# EAGLE design MySens-easyRS485-v002 (EAGLE 7.3.0)
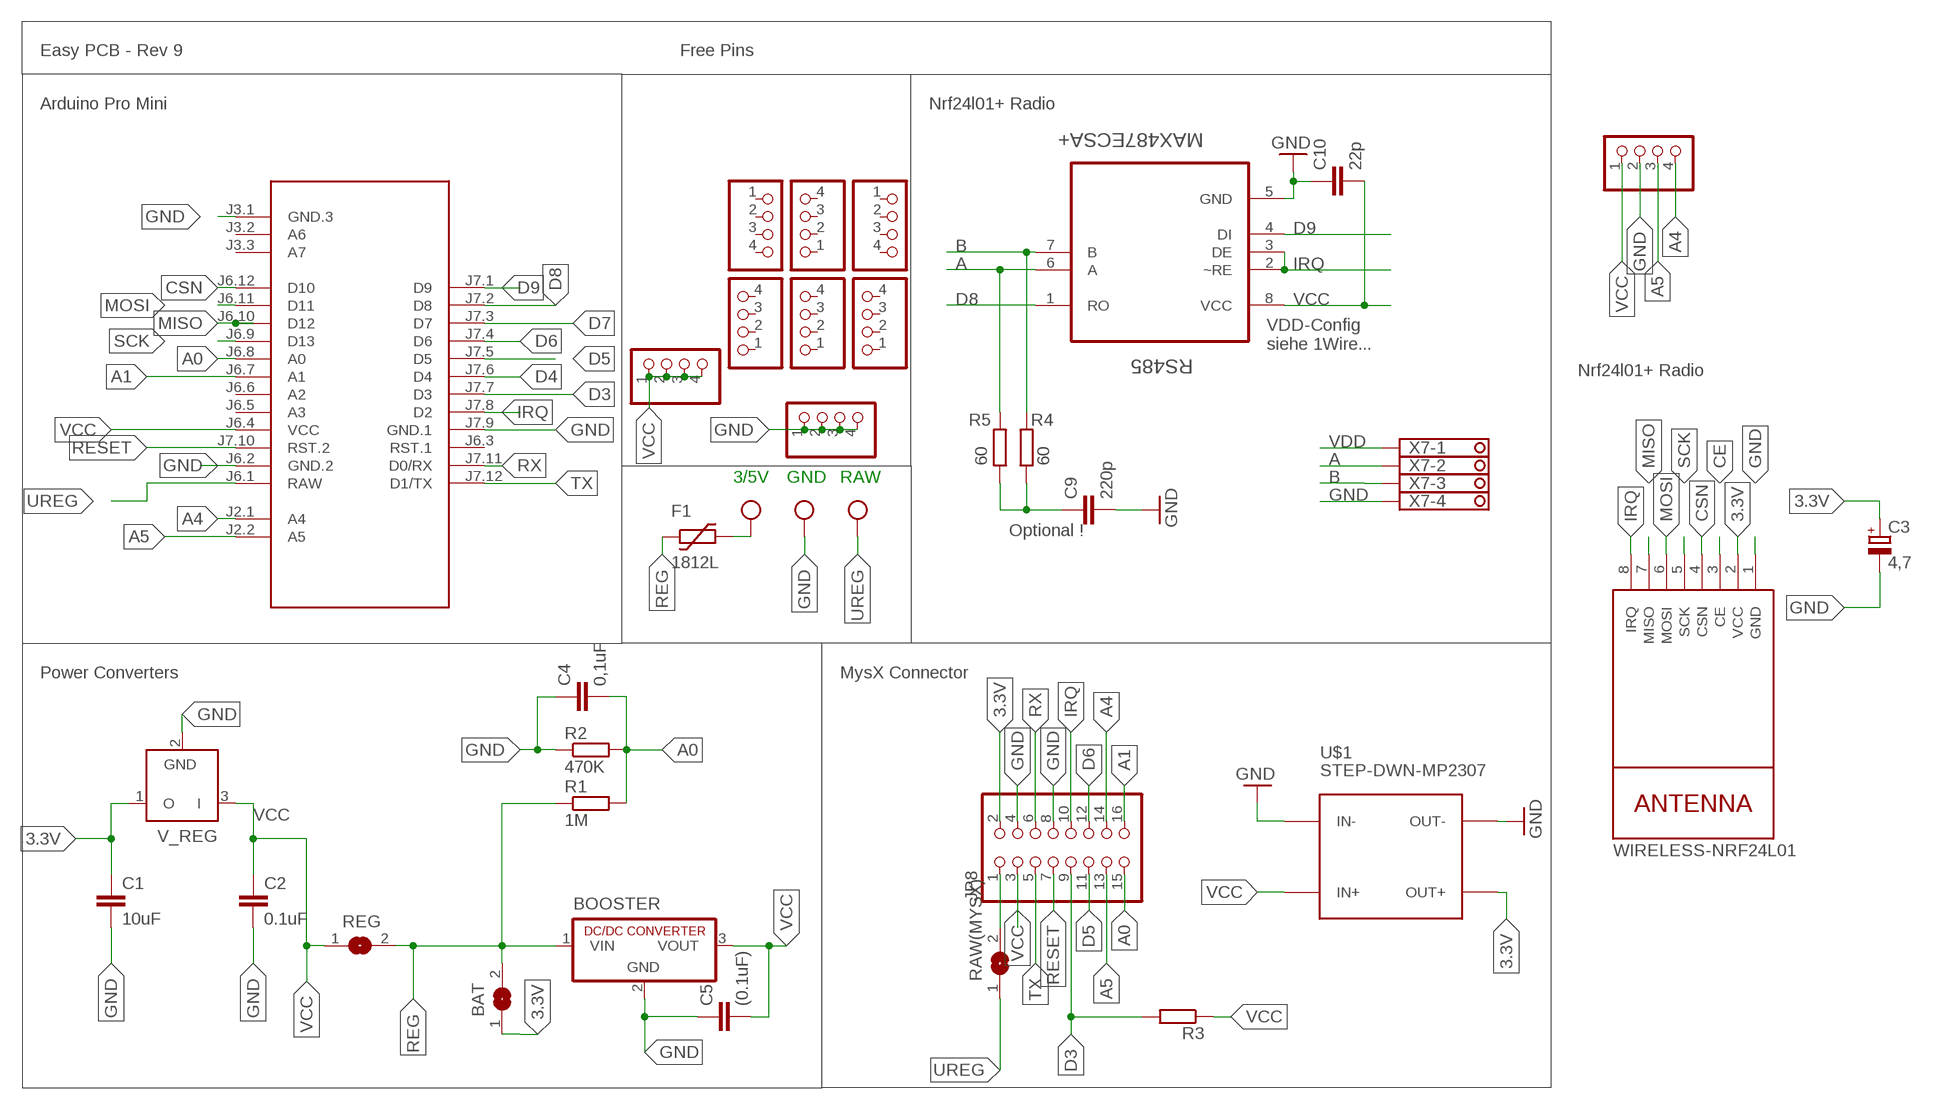
[diagram p0: schematic, sheet 1]

## Parts
.  W237-103  [W237-103]
BAT  SJ  [SJ]
BOOSTER  R-78C1.8-1.0  [SIP3]
C1  10uF  C-EUC1210  [C1210]
C2  0.1uF  C-EUC1206  [C1206]
C3  4,7  CPOL-EUSMCC  [SMC_C]
C4  0,1uF  C-EUC1206  [C1206]
C5  (0.1uF)  C-EUC1206  [C1206]
C9  220p  C-EUC0805  [C0805]
C10  22p  C-EUC0805  [C0805]
F1  1812L  [1812L]
JP1  PINHD-1X04_2.54-S  [1X04-S]
JP3  PINHD-1X04_2.54-S  [1X04-S]
JP5  PINHD-1X04_2.54-S  [1X04-S]
JP8  PINHD-2X08_2.54  [2X08]
JP10  PINHD-1X04_2.54-S  [1X04-S]
JP11  PINHD-1X04_2.54-S  [1X04-S]
JP12  PINHD-1X04_2.54-S  [1X04-S]
JP14  PINHD-1X04_2.54-S  [1X04-S]
JP15  PINHD-1X04_2.54-S  [1X04-S]
JP16  PINHD-1X04_2.54-S  [1X04-S]
M1  ARDUINO-PRO-MINI-3.3V#NP  [ARDUINO-PRO-MINI#NP]
NRF24L01+  WIRELESS-NRF24L01  [WIRELESS-NRF24L01]
R1  1M  R-EU_R0805  [R0805]
R2  470K  R-EU_R0805  [R0805]
R3  R-EU_R0805  [R0805]
R4  60  R-EU_R0805  [R0805]
R5  60  R-EU_R0805  [R0805]
RAW(MYSX)  SJ  [SJ]
REG  SJ  [SJ]
RS485  MAX487ECSA+  [SOIC127P600X175-8N]
U$1  STEP-DWN-MP2307  DC-DC-STEP-DOWN-MP2307  [DC-DC-STEP-DOWN-MP2307]
V_REG  LP2950Z  [TO92]
X7  1751264  [1751264]

## Nets
3.3V [Power]: BAT.1 C1.1 C3.+ JP8.2 NRF24L01+.2(VCC) U$1.OUT+ V_REG.1(O)
A: R5.2 RS485.6(A) X7.2
A0: C4.2 JP8.15 M1.J6.8(A0) R1.2 R2.2
A1: JP8.16 M1.J6.7(A1)
A4: JP8.14 JP10.4 M1.J2.1(A4)
A5: JP8.13 JP10.3 M1.J2.2(A5)
B: R4.2 RS485.7(B) X7.3
CE: NRF24L01+.3(CE)
CSN: M1.J6.12(D10) NRF24L01+.4(CSN)
D3: JP8.9 M1.J7.7(D3) R3.2
D4: M1.J7.6(D4)
D5: JP8.11 M1.J7.5(D5)
D6: JP8.12 M1.J7.4(D6)
D7: M1.J7.3(D7)
D8: M1.J7.2(D8) RS485.1(RO)
D9: M1.J7.1(D9) RS485.4(DI)
GND [Power]: ..2 BOOSTER.2(GND) C1.2 C2.2 C3.- C4.1 C5.1 C9.2 C10.1 JP1.1 JP1.2 JP1.3 JP1.4 JP8.4 JP8.8 JP10.2 M1.J3.1(GND.3) M1.J6.2(GND.2) M1.J7.9(GND.1) NRF24L01+.1(GND) R2.1 RS485.5(GND) U$1.IN- U$1.OUT- V_REG.2(GND) X7.4
IRQ: JP8.10 M1.J7.8(D2) NRF24L01+.8(IRQ) RS485.2(~RE) RS485.3(DE)
MISO: M1.J6.10(D12) NRF24L01+.7(MISO)
MOSI: M1.J6.11(D11) NRF24L01+.6(MOSI)
N$1: JP8.1 RAW(MYSX).2
N$2: ..3 F1.P$2
N$21: C9.1 R4.1 R5.1
REG [Power]: BAT.2 BOOSTER.1(VIN) F1.P$1 R1.1 REG.2
RESET: JP8.7 M1.J7.10(RST.2)
RX: JP8.6 M1.J7.11(D0/RX)
SCK: M1.J6.9(D13) NRF24L01+.5(SCK)
TX: JP8.5 M1.J7.12(D1/TX)
UREG [Power]: ..1 M1.J6.1(RAW) RAW(MYSX).1
VCC [Power]: BOOSTER.3(VOUT) C2.1 C5.2 C10.2 JP3.1 JP3.2 JP3.3 JP3.4 JP8.3 JP10.1 M1.J6.4(VCC) R3.1 REG.1 RS485.8(VCC) U$1.IN+ V_REG.3(I)
VDD [Power]: X7.1
Unconnected: JP5.1 JP5.2 JP5.3 JP5.4 JP11.1 JP11.2 JP11.3 JP11.4 JP12.1 JP12.2 JP12.3 JP12.4 JP14.1 JP14.2 JP14.3 JP14.4 JP15.1 JP15.2 JP15.3 JP15.4 JP16.1 JP16.2 JP16.3 JP16.4 M1.J3.2(A6) M1.J3.3(A7) M1.J6.3(RST.1) M1.J6.5(A3) M1.J6.6(A2)

## Notes on the sheet
- Easy PCB - Rev 9 | Free Pins
- Arduino Pro Mini | Nrf24l01+ Radio
- VDD-Config
  siehe 1Wire...
- Nrf24l01+ Radio
- 3/5V | GND | RAW
- Optional !
- Power Converters | MysX Connector

## Library data of the parts
. = con-wago-500:W237-103: WAGO SCREW CLAMP; MPN: 237-103; OC_FARNELL: unknown; OC_NEWARK: 18M7116
BAT RAW(MYSX) REG = jumper:SJ: SMD solder JUMPER
BOOSTER = dc-dc-converter:R-78C*-1.0: INNOLINE DC/DC-Converter 1.0 AMP SIP3 Single Output Source: Data sheet <http://www.mikrocontroller.net/attachment/150645/157764-da-01-en-DC_DC_WANDLER_R_78C5_0_1_0.pdf>
C1 C2 C4 C5 C9 C10 = rcl:C-EU: CAPACITOR, European symbol
C3 = rcl:CPOL-EU: POLARIZED CAPACITOR, European symbol
F1 = ptc-littlefuse:1812L
JP1 JP3 JP5 JP10-JP12 JP14-JP16 = pinhead-2:PINHD-1X04: PIN HEADER
JP8 = pinhead-2:PINHD-2X08: PIN HEADER
M1 = diy-modules:ARDUINO-PRO-MINI-*#NP: Arduino Pro Mini without programming pads
NRF24L01+ = diy-modules:WIRELESS-NRF24L01: 2.4 GHz Wireless Module based on NRF24L01 chip
R1-R5 = rcl:R-EU_: RESISTOR, European symbol
RS485 = Maxim_By_element14_Batch_1:MAX487ECSA+: Low-Power, Slew-Rate-Limited RS-485/RS-422 Transceivers; MPN: MAX487ECSA+; OC_FARNELL: 9724532; OC_NEWARK: 68K4803; PACKAGE: SOIC-8; SUPPLIER: Maxim
U$1 = diy-modules:DC-DC-STEP-DOWN-MP2307: DC/DC Step-Down Regulator based on MP2307DN chip MP2307 datasheet available here: https://cdn-shop.adafruit.com/datasheets/MP2307_r1.9.pdf Click here to find device on ebay.com <http://www.ebay.com/sch/dc+dc+3a+mini+converter>
V_REG = linear:LP2950: 100 mA, Low Power Low Dropout Voltage Regulator Source: http://www.onsemi.com/pub/Collateral/LP2950-D.PDF
X7 = con-phoenix-350:1751264: MKDS 1/ 4-3,5 Printklemme Nennstrom: 10 A Bemessungsspannung: 160 V Raster: 3,5 mm Polzahl: 4 Montageart: Löten Anschlussart: Schraubanschluss Anschlussrichtung vom Leiter zur Platine: 0° Source: http://eshop.phoenixcontact.com .. 1751264.pdf; MPN: 1751264; OC_FARNELL: unknown; OC_NEWARK: 10R0934

## Net classes
0 default: width 0.305 mm
1 Power: width 0.508 mm

## Board
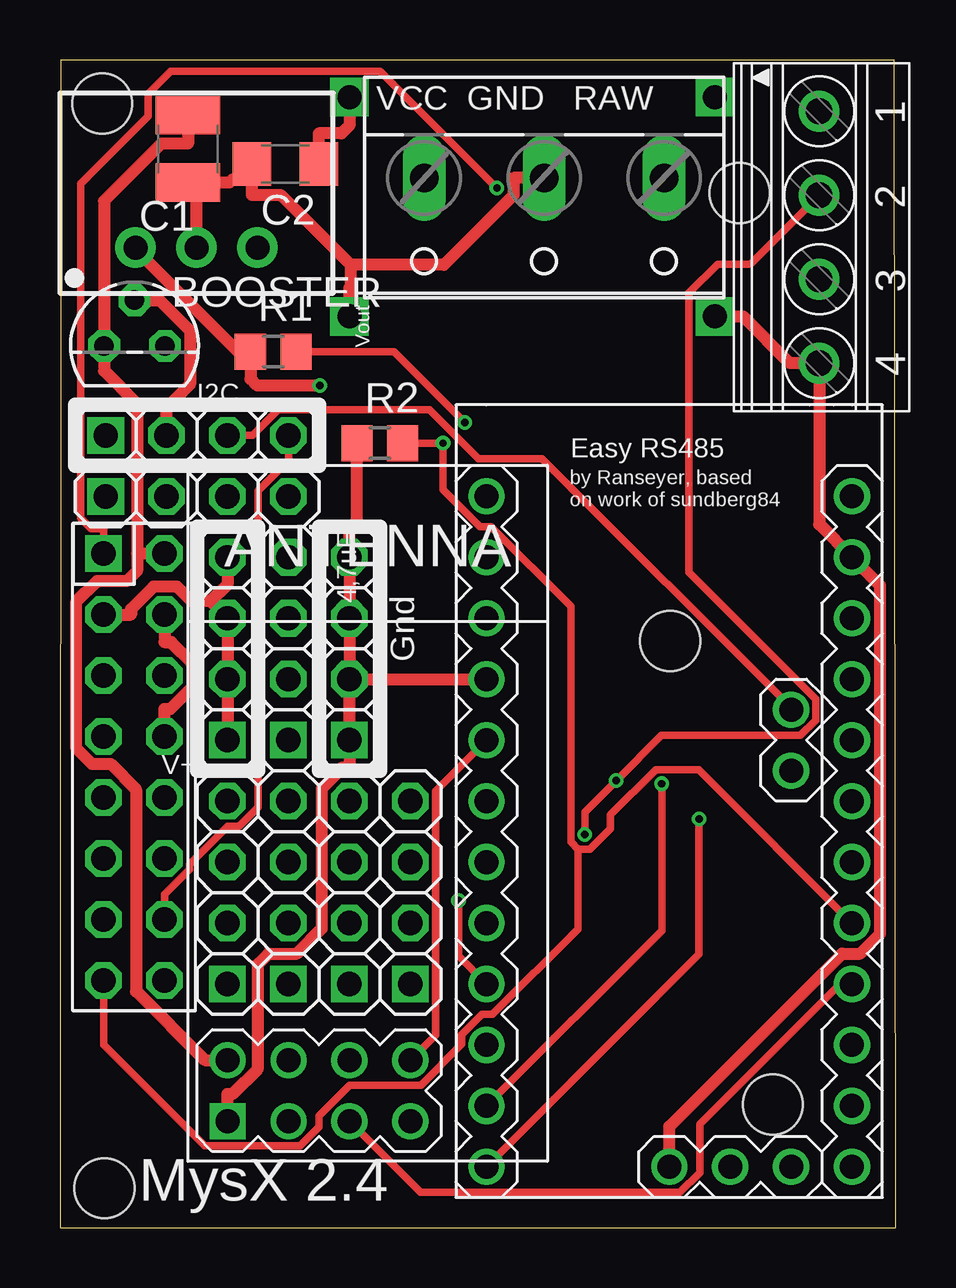
[diagram p1: board, top side]
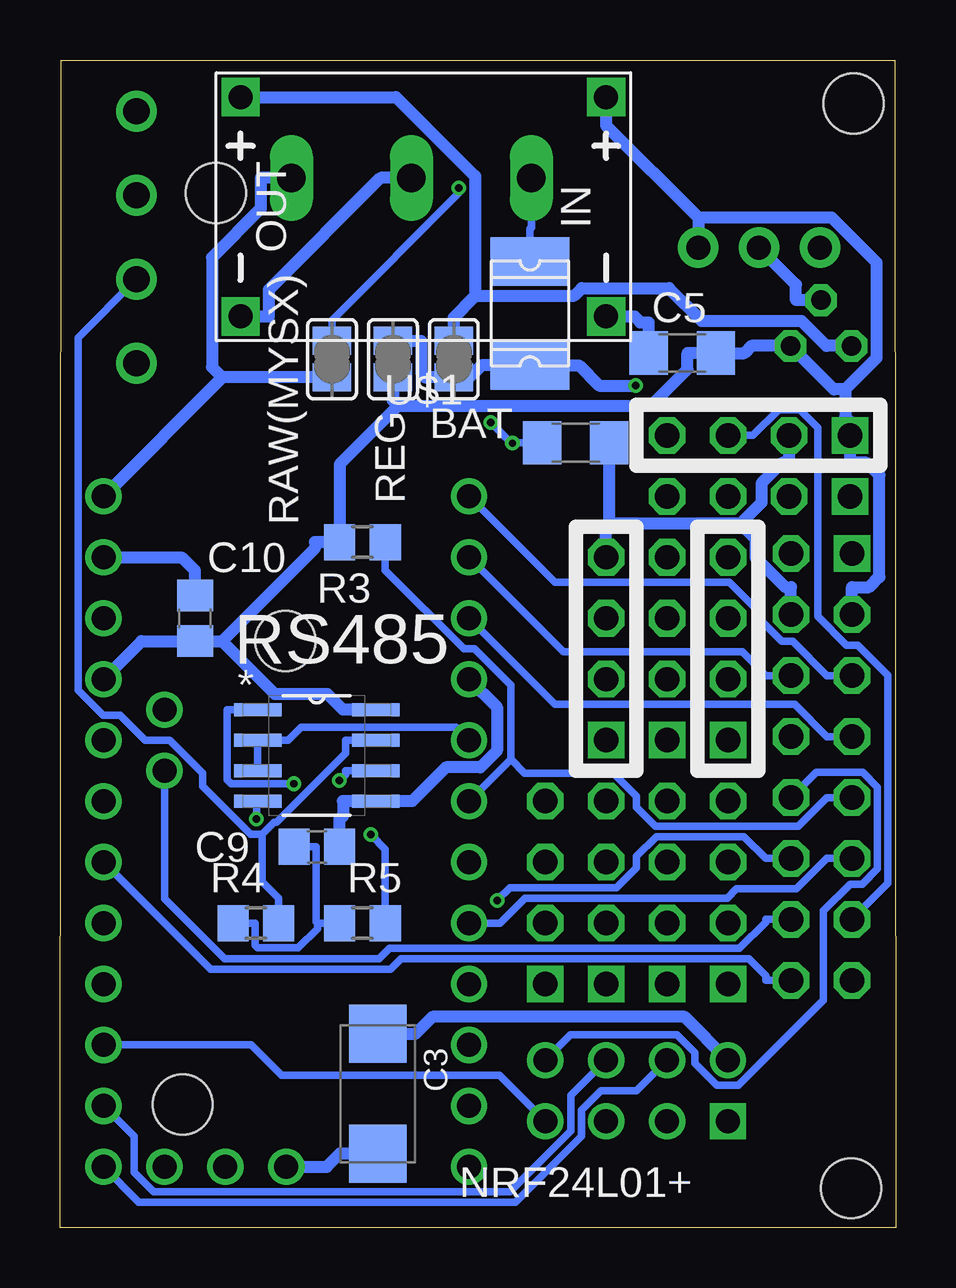
[diagram p2: board, bottom side, seen from below]

Size 34.84 x 48.66 mm. Coordinates in mm from the lower left corner, seen from the top.
Outline: 0,0 34.84,0 34.78,48.66 0.03,48.66 0,0
Copper layers (1*16): Top 0.035mm / dielectric 1.5mm / Bottom 0.035mm
Design rules "dirt_cheap_dirty_boards.v1": minimum track width 5mil, minimum drill 12mil, track to track 5mil, track to pad 5mil, pad to pad 5mil, via to via 5mil, smd to smd 0mil, copper to edge 10mil, drill to drill 10mil, minimum pad ring 10mil, minimum via ring 6mil, stop-mask expansion 2mil, vias tented up to drill 25mil, thermal gap 10mil
Holes 2.5 mm at 28.34,43.13 1.86,1.65 1.76,46.85 29.72,5.14 25.43,24.45
tRestrict: area -11.9,0.1 to 34.8,0.6
bRestrict: area -10,-0.1 to 34.9,0.6

### Footprints (pad centres in the part's own frame; a part is rotated, then mirrored left to right if it is on the bottom)
W237-103 = drill 1.194 long: 1 -5,-1.29; 2 0,-1.29; 3 5,-1.29
SJ = smd 1.168 x 1.6: 1 -0.762,0; 2 0.762,0
SIP3 = drill 1 pad 1.676: 1 -2.54,0; 2 0,0; 3 2.54,0
C1210 = smd 1.6 x 2.7: 1 -1.4,0; 2 1.4,0
C1206 = smd 1.6 x 1.8: 1 -1.4,0; 2 1.4,0
SMC_C = smd 2.4 x 2.4: + -2.5,0; - 2.5,0
C0805 = smd 1.3 x 1.5: 1 -0.95,0; 2 0.95,0
1812L = smd 2.03 x 3.3: P$1 -2.16,0; P$2 2.16,0
1X04-S = drill 1.016 square: 1 -3.81,0 | drill 1.016 octagon: 2 -1.27,0; 3 1.27,0; 4 3.81,0
2X08 = drill 1.016 square: 1 -8.89,-1.27 | drill 1.016 octagon: 2 -8.89,1.27; 3 -6.35,-1.27; 4 -6.35,1.27; 5 -3.81,-1.27; 6 -3.81,1.27; 7 -1.27,-1.27; 8 -1.27,1.27; 9 1.27,-1.27; 10 1.27,1.27; 11 3.81,-1.27; 12 3.81,1.27; 13 6.35,-1.27; 14 6.35,1.27; 15 8.89,-1.27; 16 8.89,1.27
ARDUINO-PRO-MINI#NP = drill 1: J2.1 -1.27,5.08; J2.2 -3.81,5.08; J3.1 15.24,0; J3.2 15.24,2.54; J3.3 15.24,5.08; J6.1 -12.7,7.62; J6.2 -10.16,7.62; J6.3 -7.62,7.62; J6.4 -5.08,7.62; J6.5 -2.54,7.62; J6.6 0,7.62; J6.7 2.54,7.62; J6.8 5.08,7.62; J6.9 7.62,7.62; J6.10 10.16,7.62; J6.11 12.7,7.62; J6.12 15.24,7.62; J7.1 15.24,-7.62; J7.2 12.7,-7.62; J7.3 10.16,-7.62; J7.4 7.62,-7.62; J7.5 5.08,-7.62; J7.6 2.54,-7.62; J7.7 0,-7.62; J7.8 -2.54,-7.62; J7.9 -5.08,-7.62; J7.10 -7.62,-7.62; J7.11 -10.16,-7.62; J7.12 -12.7,-7.62
WIRELESS-NRF24L01 = drill 1 square: 1 -12.7,6.35 | drill 1: 2 -10.16,6.35; 3 -12.7,3.81; 4 -10.16,3.81; 5 -12.7,1.27; 6 -10.16,1.27; 7 -12.7,-1.27; 8 -10.16,-1.27
R0805 = smd 1.3 x 1.5: 1 -0.95,0; 2 0.95,0
SOIC127P600X175-8N = smd 1.981 x 0.533: 1 -2.464,1.905; 2 -2.464,0.635; 3 -2.464,-0.635; 4 -2.464,-1.905; 5 2.464,-1.905; 6 2.464,-0.635; 7 2.464,0.635; 8 2.464,1.905
DC-DC-STEP-DOWN-MP2307 = drill 1 pad 1.6 square: IN+ -7.62,-4.572; IN- -7.62,4.572; OUT+ 7.62,-4.572; OUT- 7.62,4.572
TO92 = drill 0.813 octagon: 1 -1.27,0; 2 0,1.905; 3 1.27,0
1751264 = drill 1.1 pad 1.7: 1 -5.25,-0.1; 2 -1.75,-0.1; 3 1.75,-0.1; 4 5.25,-0.1

### Placement (x,y rotation side)
.  20.18,42.46 180 top
BAT  18.41,36.2 270 bottom
BOOSTER  5.69,40.84 0 top
C1  5.33,44.96 270 top
C2  9.4,44.32 180 top
C3  21.59,5.59 270 bottom
C4  13.34,32.71 180 bottom
C5  8.89,36.45 0 bottom
C9  24.13,15.88 0 bottom
C10  29.21,25.4 270 bottom
F1  15.24,38.1 90 bottom
JP1  12.06,24.13 90 top
JP3  6.99,24.13 90 top
JP5  9.53,13.97 90 top
JP8  3.09,19.2 270 top
JP10  5.71,33.02 0 top
JP11  6.99,13.97 90 top
JP12  14.61,13.97 90 top
JP14  9.53,24.13 90 top
JP15  5.71,30.48 0 top
JP16  12.06,13.97 90 top
M1  25.4,17.78 270 top
NRF24L01+  13.34,17.14 90 top
R1  8.89,36.51 0 top
R2  13.34,32.7 0 top
R3  22.23,28.57 0 bottom
R4  26.67,12.7 0 bottom
R5  22.23,12.7 0 bottom
RAW(MYSX)  23.5,36.2 90 bottom
REG  20.95,36.2 90 bottom
RS485  24.13,19.68 0 bottom
U$1  19.68,42.55 180 bottom
V_REG  3.11,36.75 0 top
X7  31.75,41.28 270 top

### Tracks (layer width: path | path; a pad name or v marks a point on that pad's centre or on a via)
3.3V
  Top 0.508: 3.22,28.09 3.22,34.33 1.84,35.7 V_REG.1 1.84,42.79 4.23,45.18 5.33,45.18 C1.1 | JP8.2 3.22,28.09 | 3.22,28.09 3.22,27.38 2.79,26.95 1.55,26.95 0.66,26.06 0.66,20 1.33,19.33 2.1,19.33 3.17,18.26 3.17,9.86 6.04,6.99 NRF24L01+.2
  Bottom 0.508: 17.53,38.84 13.39,38.84 13.08,39.15 9.45,39.15 8.08,37.79 3.92,37.79 2.88,36.75 V_REG.1 | 17.53,38.84 17.53,38.81 18.41,37.92 BAT.1 | U$1.OUT+ 20.82,47.12 17.53,43.82 17.53,38.84 | C3.+ 20.01,8.09 19.31,8.79 8.79,8.79 NRF24L01+.2
A  (via drill 0.3 pad 0.61)
  Top 0.305: X7.2 28.78,40.15 27.42,40.15 26.23,38.96 26.23,27.32 31.51,22.03 31.51,21.16 30.87,20.52 25.07,20.52 v23.19,18.64 21.88,17.32 v21.88,16.39
  Bottom 0.305: v21.88,16.39 21.27,15.78 R5.2 | v23.19,18.64 22.94,18.89 22.94,19.05 RS485.6
A0  (via drill 0.3 pad 0.61)
  Top 0.305: R1.2 13.92,36.51 v16.88,33.55 | 21.59,15.78 22.1,15.78 22.95,16.63 22.95,17.2 24.84,19.09 26.63,19.09 M1.J6.8 | 21.59,15.78 21.29,16.08 21.29,25.89 17.97,29.21 17.51,29.21 15.97,30.75 v15.97,32.7 R2.2 | JP8.15 1.82,7.63 6.04,3.41 10,3.41 10.79,4.21 10.79,4.68 12.07,5.95 15.04,5.95 16.75,7.66 16.75,8.05 17.59,8.89 18.04,8.89 21.59,12.45 21.59,15.78
  Bottom 0.305: v16.88,33.55 16.02,32.7 v15.97,32.7 15.83,32.7 15.81,32.71 C4.2
A1
  Bottom 0.305: M1.J6.7 28.55,10.77 21.05,10.77 20.61,11.21 6.11,11.21 5.4,10.5 5.4,10.31 JP8.16
A4
  Top 0.305: JP10.4 9.53,31.98 8.26,30.71 8.26,17.53 7.46,16.74 6.99,16.74 5.4,15.16 5.4,14.93 4.36,13.89 JP8.14
  Bottom 0.305: JP8.14 5.4,12.85 5.4,12.74 6.5,11.64 21.09,11.64 21.52,11.21 27.97,11.21 30.48,13.72 M1.J2.1
A5
  Top 0.305: JP10.3 8.03,33.02 9.09,34.08 15.41,34.08 17.44,32.06 20.1,32.06 30.48,21.67 M1.J2.2
  Bottom 0.305: JP10.3 5.94,33.02 4.87,34.09 3.99,34.09 3.24,33.35 3.24,25.48 2.05,24.28 1.57,24.28 0.32,23.02 0.32,14.36 JP8.13
B
  Bottom 0.305: 26.4,16.4 26.4,14.41 25.72,13.73 R4.2 | 26.4,16.4 25.9,16.91 25.8,16.91 22.94,19.77 22.94,20.32 RS485.7 | 26.4,16.4 26.89,16.4 28.88,18.39 28.88,18.94 30.26,20.32 31.29,20.32 32.33,21.36 33.04,21.36 34.08,22.4 34.08,37.1 X7.3
CSN
  Bottom 0.305: NRF24L01+.4 10.79,5.71 12.28,5.71 13.1,4.89 13.1,3.81 15.84,1.07 31.55,1.07 M1.J6.12
D3
  Bottom 0.305: 16.04,19.52 M1.J7.7 | R3.2 21.27,27.4 18,24.13 17.56,24.13 16.04,22.61 16.04,19.52 | 16.04,19.52 15.47,18.95 11.76,18.95 10.79,17.99 10.79,17.52 10.01,16.74 4.05,16.74 2.86,17.93 JP8.9
D5
  Bottom 0.305: JP8.11 2.86,15.39 4.13,14.12 6.63,14.12 7.01,13.74 15.45,13.74 16.49,12.7 M1.J7.5
D6  (via drill 0.3 pad 0.61)
  Top 0.305: M1.J7.4 16.61,11.33 v16.61,13.64
  Bottom 0.305: JP8.12 5.4,15.39 6.32,16.3 9.98,16.3 10.79,15.49 10.79,15.01 11.63,14.17 16.08,14.17 v16.61,13.64
D8  (via drill 0.3 pad 0.61)
  Top 0.305: M1.J7.2 25.08,12.38 v25.08,18.5
  Bottom 0.305: v25.08,18.5 27.7,18.5 27.86,18.67 27.86,21.59 RS485.1
D9  (via drill 0.3 pad 0.61)
  Top 0.305: M1.J7.1 26.65,11.41 v26.65,17.04
  Bottom 0.305: RS485.4 26.65,17.73 v26.65,17.04
GND
  Top 0.508: R2.1 12.38,29.4 12.06,29.08 JP1.4 JP1.3 JP1.2 | NRF24L01+.1 6.99,5.58 7.2,5.58 8.26,6.64 8.26,10.99 8.69,11.43 9.88,11.43 10.92,12.48 10.92,18.32 11.78,19.18 12.06,19.18 JP1.1 JP1.2 | 5.69,43.56 7.07,43.56 7.19,43.68 8,43.68 | C1.2 5.69,43.56 | BOOSTER.2 | BOOSTER.2 5.69,43.56 | 8,43.68 8,43.04 9.2,43.04 12.11,40.13 | C2.2 8,43.68 | JP10.2 4.45,34.16 5.43,35.15 5.43,37.38 4.15,38.65 V_REG.2 | JP8.8 4.36,21.61 4.6,21.61 5.53,22.54 5.53,23.53 4.65,24.41 4.36,24.41 JP8.4 | U$1.IN- 12.06,39.15 12.11,39.2 12.11,40.13 | 12.11,40.13 16,40.13 18.91,43.03 18.91,43.75 ..2 | U$1.OUT- 28.49,37.97 30.43,36.03 X7.4 31.65,29.31 M1.J6.2 34.2,26.76 34.2,12.26 33.36,11.43 32.61,11.43 25.4,4.22 M1.J3.1 | JP1.2 M1.J7.9
  Bottom 0.508: 6.47,29.34 11.94,29.34 | 6.47,29.34 5.59,30.22 5.59,31.02 4.73,31.88 4.45,31.88 JP10.2 | 6.47,29.34 5.84,28.71 5.84,27.94 4.6,26.69 4.36,26.69 JP8.4 | 11.94,29.34 C4.1 | 11.94,29.34 11.94,29.21 12.06,29.08 JP1.4 | C5.1 10.29,37.73 10.64,37.73 10.88,37.97 U$1.IN- | M1.J7.9 16.62,21.7 16.62,19.87 17.31,19.18 18.75,19.18 20.15,17.78 RS485.5 23.04,17.78 23.04,17.15 23.18,17.01 C9.2 | U$1.OUT- 26.12,37.97 26.12,39.09 21.46,43.75 ..2 | C3.- 23.17,3.09 23.72,2.54 M1.J3.1 | C10.1 29.21,27.38 29.77,27.94 M1.J6.2 | V_REG.2 4.15,38.65 4.15,39.31 BOOSTER.2
IRQ
  Top 0.305: M1.J7.8 15.65,18.19 15.65,8.03 NRF24L01+.8
  Bottom 0.305: NRF24L01+.8 13.55,8.04 9.12,8.04 8.37,7.29 8.37,6.86 7.45,5.94 6.55,5.94 3.01,9.48 3.01,13.21 1.89,14.32 1.39,14.32 0.75,14.96 0.75,18.35 1.38,18.98 3.31,18.98 JP8.10 | M1.J7.8 18.33,20.87 24.78,20.87 25.32,20.32 RS485.2 RS485.3
MISO
  Bottom 0.305: NRF24L01+.7 16.51,6.35 25.6,6.35 26.87,7.62 M1.J6.10
MOSI
  Bottom 0.305: NRF24L01+.6 13.53,5.52 13.53,4.06 16.08,1.5 30.93,1.5 31.75,2.32 31.75,3.81 M1.J6.11
N$1  (via drill 0.3 pad 0.61)
  Top 0.305: JP8.1 1.82,29.13 1.3,29.13 0.86,29.57 0.86,43.5 3.67,46.31 3.67,47.25 4.62,48.2 13.34,48.2 v18.21,43.33
  Bottom 0.305: RAW(MYSX).2 23.5,37.82 18.21,43.1 v18.21,43.33
N$2
  Bottom 0.305: ..3 15.19,41.68 15.24,41.62 F1.P$2
N$21
  Bottom 0.305: R4.1 26.69,12.7 26.69,11.77 26.59,11.67 24.9,11.67 24.11,12.47 24.11,12.7 | R5.1 24.11,12.7 | C9.1 24.15,15.88 24.15,12.75 24.11,12.7
REG  (via drill 0.3 pad 0.61)
  Top 0.508: v10.84,35.09 8.22,35.09 7.94,35.37 R1.1 7.42,36.51 3.15,40.78 BOOSTER.1
  Bottom 0.508: REG.2 19.77,36.96 19.77,35.61 19.6,35.43 BAT.2 17.78,35.43 17.27,35.94 F1.P$1 13.21,35.94 12.36,35.09 v10.84,35.09
RESET
  Bottom 0.305: M1.J7.10 14.19,21.81 4.2,21.81 2.86,20.47 JP8.7
RX
  Bottom 0.305: JP8.6 5.4,23.01 6.39,24 13.84,24 M1.J7.11
SCK
  Top 0.305: NRF24L01+.5 15.03,1.48 25.85,1.48 26.67,2.31 26.67,4.32 32.51,10.16 M1.J6.9
TX
  Bottom 0.305: JP8.5 2.86,23.01 4.28,24.43 4.74,24.43 5.6,25.29 5.6,25.57 6.93,26.9 14.2,26.9 M1.J7.12
UREG
  Bottom 0.508: ..1 26.46,43.75 26.46,42.47 28.5,40.43 28.5,35.87 28.07,35.43 | 28.07,35.43 M1.J6.1 | RAW(MYSX).1 28.07,35.43
VCC
  Top 0.508: 6.29,26.1 5.5,26.1 4.88,26.72 3.9,26.72 2.96,25.78 2.96,25.55 JP8.3 | 6.29,26.1 6.99,26.8 JP3.4 | 6.29,26.1 JP3.3 JP3.2 JP3.1 | C2.1 10.8,45.6 11.73,45.6 12.06,45.94 U$1.IN+
  Bottom 0.508: 2.1,34.93 2.57,34.93 V_REG.3 6.01,36.75 6.31,36.45 C5.2 8.67,36.45 8.67,35.79 10.21,34.25 20.74,34.25 | 2.1,34.93 2.1,33.78 1.91,33.59 JP10.1 1.91,31.88 1.19,31.88 0.68,31.36 0.68,27.12 1.11,26.69 1.82,26.69 JP8.3 | 8.23,42.1 2.67,42.1 0.8,40.23 0.8,36.24 2.1,34.93 | RS485.8 23.04,21.59 23.69,22.24 25.87,22.24 28.08,24.45 | 20.74,34.25 23.18,31.81 R3.1 24.21,28.57 24.21,28.32 28.08,24.45 | 20.74,34.25 20.95,34.47 REG.1 | M1.J6.4 31.43,24.45 C10.2 28.08,24.45 | 8.23,42.1 BOOSTER.3 | 8.23,42.1 12.06,45.94 U$1.IN+

### Text on the board
tPlace: Vout | Easy RS485 | by Ranseyer, based / on work of sundberg84 | Gnd | MysX 2.4
tNames: VCC GND RAW | I2C | 4,7uF | V+